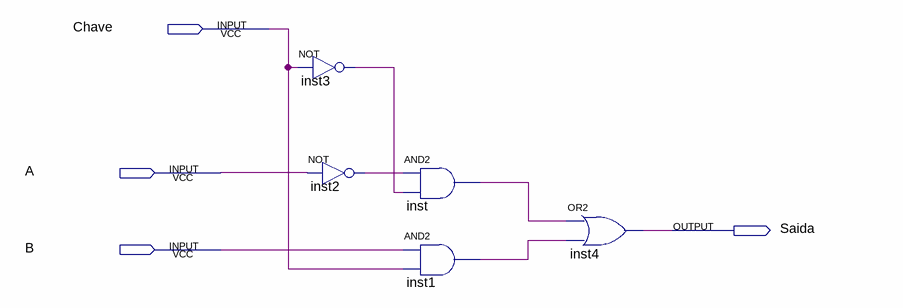
[diagram p0: schematic sheet]
// Quartus schematic MUX.bdf as structural Verilog: 5 symbols, 4 pins
module MUX (
  input  Chave,
  input  A,
  input  B,
  output Saida
);

  wire inst1_out, inst2_out, inst3_out, inst_out;

  not inst3 (inst3_out, Chave);
  not inst2 (inst2_out, A);
  and inst (inst_out, inst2_out, inst3_out);
  and inst1 (inst1_out, B, Chave);
  or inst4 (Saida, inst_out, inst1_out);
endmodule
